# EAGLE design combined_controller (EAGLE 7.0.0)
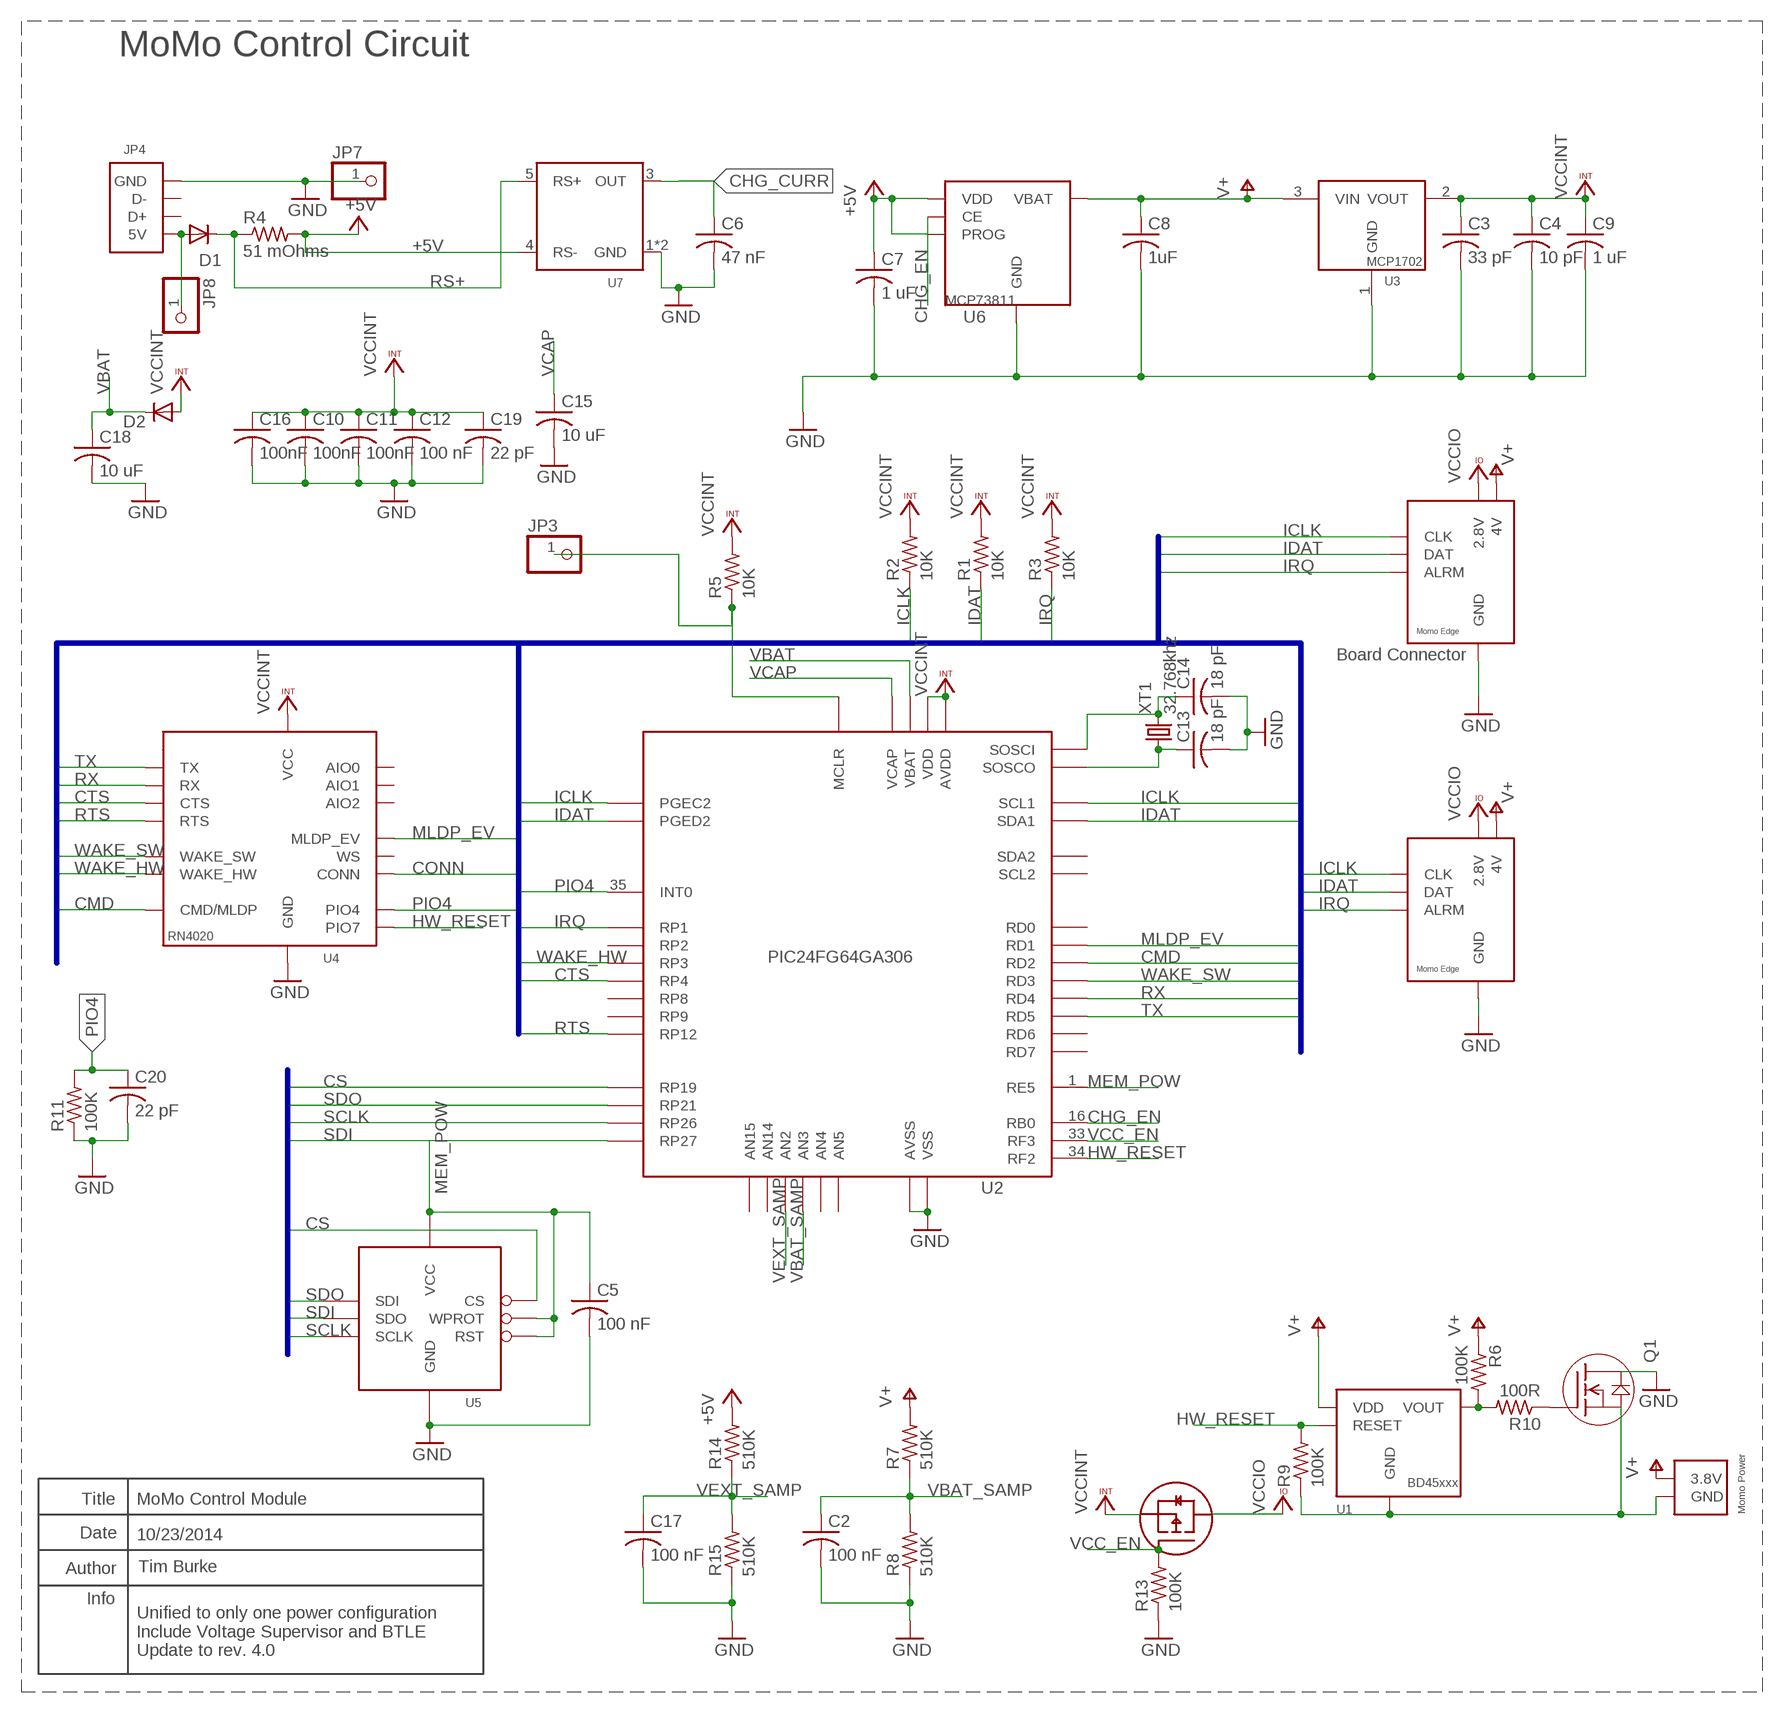
[diagram p0: schematic, sheet 1]

## Parts
C2  100 nF  C-USC0402K  [C0402K]
C3  33 pF  C-USC0402K  [C0402K]
C4  10 pF  C-USC0402K  [C0402K]
C5  100 nF  C-USC0402K  [C0402K]
C6  47 nF  C-USC0402K  [C0402K]
C7  1 uF  C-USC0402K  [C0402K]
C8  1uF  C-USC0402K  [C0402K]
C9  1 uF  C-USC0402K  [C0402K]
C10  100nF  C-USC0402K  [C0402K]
C11  100nF  C-USC0402K  [C0402K]
C12  100 nF  C-USC0402K  [C0402K]
C13  18 pF  C-USC0402K  [C0402K]
C14  18 pF  C-USC0402K  [C0402K]
C15  10 uF  C-USC0805K  [C0805K]
C16  100nF  C-USC0402K  [C0402K]
C17  100 nF  C-USC0402K  [C0402K]
C18  10 uF  C-USC0805K  [C0805K]
C19  22 pF  C-USC0402K  [C0402K]
C20  22 pF  C-USC0402K  [C0402K]
D1  DIODE-SC79_INFINEON  [SC79_INFINEON]
D2  DIODE-SC79_INFINEON  [SC79_INFINEON]
JP1  MOMO-VERT-6M  [1X06]
JP2  MOMO-EDGE-6F  [MOMO-EDGE-8F]
JP3  PINHD-1X1  [1X01]
JP4  CONN-MICROUSB-B-RCPT  [MICROUSB-B-FCI]
JP5  MOMO-PWR-HOUSED  [MOMO-PWR-HOUSED]
JP7  PINHD-1X1  [1X01]
JP8  PINHD-1X1  [1X01]
Q1  MOSFET-N  [SOT-23]
Q2  P-MOSFET  [SOT23]
R1  10K  R-US_R0603  [R0603]
R2  10K  R-US_R0603  [R0603]
R3  10K  R-US_R0603  [R0603]
R4  51 mOhms  R-US_R0805  [R0805]
R5  10K  R-US_R0603  [R0603]
R6  100K  R-US_R0603  [R0603]
R7  510K  R-US_R0603  [R0603]
R8  510K  R-US_R0603  [R0603]
R9  100K  R-US_R0603  [R0603]
R10  100R  R-US_R0603  [R0603]
R11  100K  R-US_R0603  [R0603]
R13  100K  R-US_R0603  [R0603]
R14  510K  R-US_R0603  [R0603]
R15  510K  R-US_R0603  [R0603]
U1  VOLTAGE-SUPERVISOR-BD45312  [SSOP-5]
U2  PIC24FJ64GA306  [TQFP64-10X10]
U3  MCP1702  [SOT23]
U4  RN4020_BT_4.0_MODULE  [RN20-BTLE-MODULE]
U5  FLASH8MSOP8  [SOP08]
U6  MCP73811  [SOT23-5L]
U7  TS1102-CURRENT-SENSE  [SOT23-5L]
XT1  32.768khz  XTAL-W-CAN-PAD  [TC26H]

## Nets
+5V: C7.1 R4.2 R14.2 U6.4(VDD) U6.5(PROG) U7.4(RS-)
CHG_CURR: C6.1 U7.3(OUT)
CHG_EN: U2.16(RB0) U6.1(CE)
CMD: U2.50(RD2) U4.CMD/MLDP
CONN: U4.PIO1(CONN)
CS: U2.6(RP19) U5.1(CS)
CTS: U2.43(RP4) U4.PIO5(CTS)
GND: C2.2 C3.2 C4.2 C5.2 C6.2 C7.2 C8.2 C9.2 C10.2 C11.2 C12.2 C13.2 C14.2 C15.2 C16.2 C17.2 C18.2 C19.2 C20.2 JP1.7(GND) JP2.GND JP4.5(GND) JP4.GND1(GND) JP4.GND2(GND) JP4.GND3(GND) JP4.GND4(GND) JP4.GND5(GND) JP4.GND6(GND) JP7.1 Q1.3(D) R8.1 R11.1 R13.1 R15.1 U2.9(VSS) U2.20(AVSS) U2.25(VSS) U2.41(VSS) U3.1(GND) U4.GND U4.GND1(GND) U4.SHIELD1(GND) U4.SHIELD2(GND) U4.SHIELD3(GND) U4.SHIELD4(GND) U5.4(GND) U6.2(GND) U7.1(GND) U7.2(GND)
HW_RESET: R9.2 U1.1(RESET) U2.34(RF2) U4.PIO7
ICLK: JP1.3(CLK) JP2.CLK R2.1 U2.17(PGEC2) U2.37(SCL1)
IDAT: JP1.4(DAT) JP2.DAT R1.1 U2.18(PGED2) U2.36(SDA1)
IRQ: JP1.5(ALRM) JP2.ARLM(ALRM) R3.1 U2.15(RP1)
MEM_POW: C5.1 U2.1(RE5) U5.3(WPROT) U5.7(RST) U5.8(VCC)
MLDP_EV: U2.49(RD1) U4.PIO2(MLDP_EV)
N$1: Q1.1(G) R10.1
N$4: JP3.1 R5.1 U2.7(MCLR)
N$5: JP5.2(GND) Q1.2(S) R9.1 U1.2(GND) U1.3(GND)
N$6: C14.1 U2.47(SOSCI) XT1.2
N$7: C13.1 U2.48(SOSCO) XT1.1
N$8: R6.2 R10.2 U1.4(VOUT)
N$9: D1.A JP4.1(5V) JP8.1
PIO4: C20.1 R11.2 U2.35(INT0) U4.PIO4
RS+: D1.C R4.1 U7.5(RS+)
RTS: U2.45(RP12) U4.RTS/PIO6(RTS)
RX: U2.52(RD4) U4.UART_RX(RX)
SCLK: U2.5(RP26) U5.6(SCLK)
SDI: U2.8(RP27) U5.2(SDO)
SDO: U2.4(RP21) U5.5(SDI)
TX: U2.53(RD5) U4.UART_TX(TX)
V+: C8.1 JP1.6(4V) JP2.V4(4V) JP5.1(3.8V) R6.1 R7.2 U1.5(VDD) U3.3(VIN) U6.3(VBAT)
VBAT: C18.1 D2.C U2.57(VBAT)
VBAT_SAMP: C2.1 R7.1 R8.2 U2.13(AN3)
VCAP: C15.1 U2.56(VCAP)
VCC_EN: Q2.1(GATE) R13.2 U2.33(RF3)
VCCINT: C3.1 C4.1 C9.1 C10.1 C11.1 C12.1 C16.1 C19.1 D2.A Q2.2(SOURCE) R1.2 R2.2 R3.2 R5.2 U2.10(VDD) U2.19(AVDD) U2.26(VDD) U2.38(VDD) U3.2(VOUT) U4.VDD(VCC)
VCCIO: JP1.1(2.8V) JP2.V28(2.8V) Q2.3(DRAIN)
VEXT_SAMP: C17.1 R14.1 R15.2 U2.14(AN2)
WAKE_HW: U2.44(RP3) U4.WAKE_HW
WAKE_SW: U2.51(RD3) U4.WAKE_SW
Unconnected: JP4.2(D-) JP4.3(D+) U2.11(AN5) U2.12(AN4) U2.21(RP8) U2.22(RP9) U2.29(AN14) U2.30(AN15) U2.31(SDA2) U2.32(SCL2) U2.42(RP2) U2.46(RD0) U2.54(RD6) U2.55(RD7) U4.AIO0 U4.AIO1 U4.AIO2 U4.PIO3(WS)

## Buses
SPI:CS,SDI,SDO,SCLK
SENSOR:ICLK,IDAT,IRQ,RTS,CTS,RX,TX,WAKE_SW,WAKE_HW,CMD,MLDP_EV,CONN,PIO4,PIO7

## Notes on the sheet
- MoMo Control Circuit
- Board Connector
- Title | MoMo Control Module
- Date | 10/23/2014
- Author | Tim Burke
- Info
- Unified to only one power configuration
  Include Voltage Supervisor and BTLE
  Update to rev. 4.0

## Library data of the parts
C2 C5 C10-C12 C16 C17 = rcl:C-US: CAPACITOR, American symbol; DIGIKEY-PN: 445-1265-1-ND
C3 = rcl:C-US: CAPACITOR, American symbol; DIGIKEY-PN: 1276-1272-1-ND
C4 = rcl:C-US: CAPACITOR, American symbol; DIGIKEY-PN: 1276-1139-1-ND
C6 = rcl:C-US: CAPACITOR, American symbol; DIGIKEY-PN: 1276-1573-1-ND
C7-C9 = rcl:C-US: CAPACITOR, American symbol; DIGIKEY-PN: 445-4114-1-ND
C13 C14 = rcl:C-US: CAPACITOR, American symbol; DIGIKEY-PN: 445-1238-1-ND
C15 C18 = rcl:C-US: CAPACITOR, American symbol; DIGIKEY-PN: 1276-2893-1-ND
C19 C20 = rcl:C-US: CAPACITOR, American symbol; DIGIKEY-PN: 1276-1116-1-ND
D1 D2 = diode:DIODE-: DIODE
JP1 = components:MOMO-VERT-6M; DIGIKEY-PN: S1011EC-06-ND
JP2 = components:MOMO-EDGE-6F; DESCRIPTION: 6-pin female R/A header; DIGIKEY-PN: S5442-ND; FOOTPRINT: Through Hole
JP3 = pinhead:PINHD-1X1: PIN HEADER; POPULATE: no
JP4 = custom_ics:CONN-MICROUSB-B-RCPT; DESCRIPTION: MicroUSB-B Receptacle; DIGIKEY-PN: 609-4613-1-ND; FOOTPRINT: Custom SMD
JP5 = components:MOMO-PWR-HOUSED; DESCRIPTION: R/A Shrouded 2 pin connector; DIGIKEY-PN: 455-1719-ND; FOOTPRINT: Through HOle
JP7 JP8 = pinhead:PINHD-1X1: PIN HEADER
Q1 = custom_ics:MOSFET-N; DESCRIPTION: N-Channel MOSFET IRLML2502; DIGIKEY-PN: IRLML2502PBFCT-ND; FOOTPRINT: SOT-23
Q2 = components:P-MOSFET; DESCRIPTION: P Channel MOSFET; DIGIKEY-PN: IRLML6401PBFCT-ND
R1-R3 R5 = rcl:R-US_: RESISTOR, American symbol; DIGIKEY-PN: P10.0KHCT-ND
R4 = rcl:R-US_: RESISTOR, American symbol; DIGIKEY-PN: RHM.051NCT-ND
R6 R9 R11 R13 = rcl:R-US_: RESISTOR, American symbol; DIGIKEY-PN: P100KHCT-ND
R7 R8 R14 R15 = rcl:R-US_: RESISTOR, American symbol; DIGIKEY-PN: P510KHCT-ND
R10 = rcl:R-US_: RESISTOR, American symbol; DIGIKEY-PN: RHM100CFCT-ND
U1 = custom_ics:VOLTAGE-SUPERVISOR-BD45312; DESCRIPTION: BD45312 Voltage Supervisor IC; DIGIKEY-PN: BD45312GCT-ND; FOOTPRINT: SSOP5
U2 = components:PIC24FJ64GA306; DESCRIPTION: PIC24FJ64GA306 Microcontroller; DIGIKEY-PN: PIC24FJ64GA306-I/PT-ND; FOOTPRINT: TQFN64-10mm
U3 = components:MCP1702; DESCRIPTION: MCP1702 2.8V Linear Regulator; DIGIKEY-PN: MCP1702T-2802E/CBCT-ND
U4 = custom_ics:RN4020_BT_4.0_MODULE; DESCRIPTION: RN4020 Bluetooth 4.0 Module; DIGIKEY-PN: RN4020-V/RM-ND; FOOTPRINT: Custom SMD
U5 = components:FLASH8M; DESCRIPTION: M25PX80 1MB Serial Flash; DIGIKEY-PN: M25PX80-VMN6TPCT-ND
U6 = components:MCP73811; DESCRIPTION: MCP73811 Lithium Ion Battery Charge Controller; DIGIKEY-PN: MCP73811T-420I/OTCT-ND; FOOTPRINT: SOT23-5
U7 = custom_ics:TS1102-CURRENT-SENSE; DESCRIPTION: TS1102 Current Sense Amplifier; DIGIKEY-PN: 336-3050-1-ND; FOOTPRINT: SOT23-5
XT1 = components:XTAL-W-CAN-PAD; DESCRIPTION: Quartz Crystal (Radial Can); DIGIKEY-PN: 535-9034-ND; FOOTPRINT: Through Hole

## Net classes
0 default: width 0.152 mm, drill 0.305 mm, clearance 0.152 mm

## Board
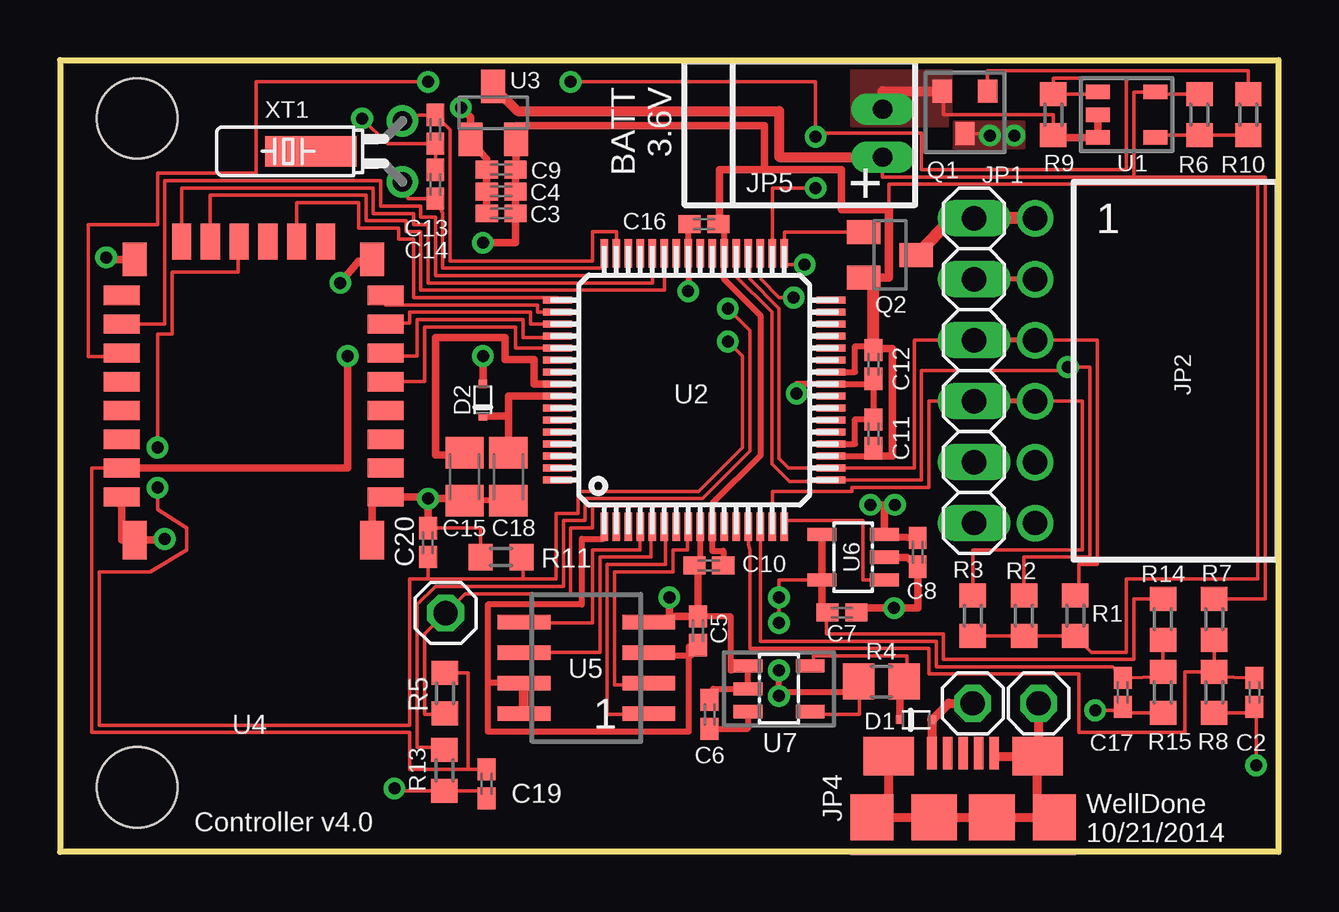
[diagram p1: board, top side]
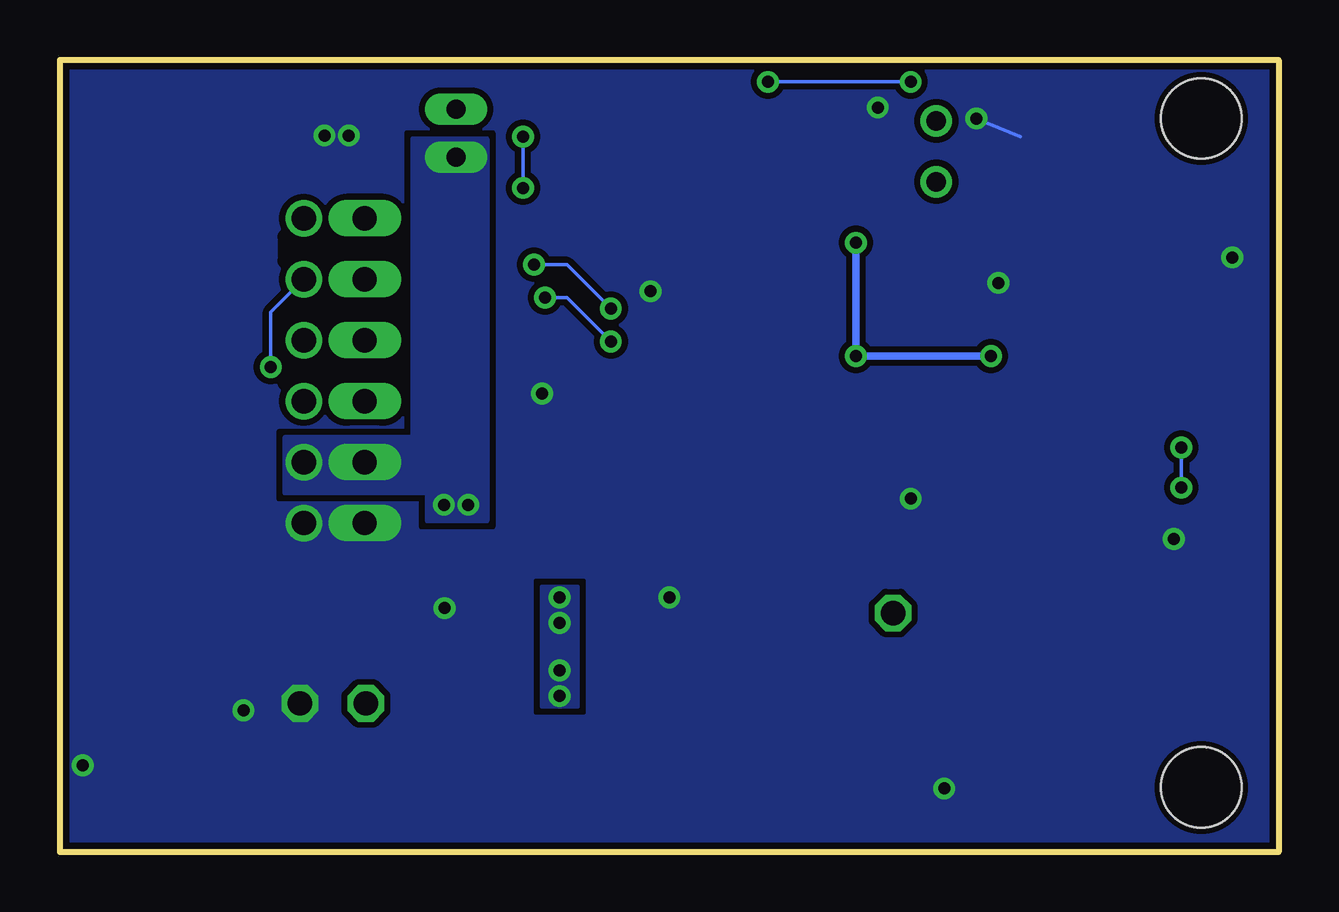
[diagram p2: board, bottom side, seen from below]

Size 50.8 x 33.02 mm. Coordinates in mm from the lower left corner, seen from the top.
Outline: 50.8,0 50.8,33.02 0,33.02 0,0 50.8,0
Copper layers (1*16): Top 0.035mm / dielectric 1.5mm / Bottom 0.035mm
Design rules "default *": minimum track width 6mil, minimum drill 19mil, track to track 6mil, track to pad 6mil, pad to pad 6mil, via to via 6mil, smd to smd 6mil, copper to edge 10mil, drill to drill 8mil, minimum pad ring 10mil, minimum via ring 8mil, stop-mask expansion 4mil, vias tented up to drill 0mil, thermal gap 10mil
Holes 3.35 mm at 3.23,2.69 3.23,30.58
bRestrict: area 41.1,19.6 to 41.4,20.6; area 41.1,24.6 to 41.4,25.7; area 41.1,22 to 41.4,22.8

### Footprints (pad centres in the part's own frame; a part is rotated, then mirrored left to right if it is on the bottom)
C0402K = smd 0.925 x 0.74: 1 -0.6,0; 2 0.6,0
C0805K = smd 1.3 x 1.6: 1 -1,0; 2 1,0
SC79_INFINEON = smd 0.35 x 0.35: A 0.675,0; C -0.675,0
1X06 = drill 1.016 long: 1 -8.89,0; 3 -6.35,0; 4 -3.81,0; 5 -1.27,0; 6 1.27,0; 7 3.81,0
MOMO-EDGE-8F = drill 1.016: ARLM 0,2.54; CLK 0,7.62; DAT 0,5.08; GND 0,-2.54; V4 0,0; V28 0,10.16
1X01 = drill 1.016 octagon: 1 0,0
MICROUSB-B-FCI = smd 0.4 x 1.35: 1 -1.3,2.675; 2 -0.65,2.675; 3 0,2.675; 4 0.65,2.675; 5 1.3,2.675 | smd 2.1 x 1.6: GND1 -3.1,2.55; GND2 3.1,2.55 | smd 1.8 x 1.9: GND3 -3.8,0; GND6 3.8,0 | smd 1.9 x 1.9: GND4 -1.2,0; GND5 1.2,0
MOMO-PWR-HOUSED = drill 0.8 long: 1 -1,0; 2 1,0
SOT-23 = smd 0.802 x 0.972: 1 -0.95,-0.885; 2 0.95,-0.885; 3 0,0.885
SOT23 = smd 1 x 1.4: 1 -0.95,-1.1; 2 0.95,-1.1; 3 0,1.1
R0603 = smd 1 x 1.1: 1 -0.85,0; 2 0.85,0
R0805 = smd 1.3 x 1.5: 1 -0.95,0; 2 0.95,0
SSOP-5 = smd 0.6 x 1: 1 0.95,1.2; 2 0,1.2; 3 -0.95,1.2; 4 -0.95,-1.2; 5 0.95,-1.2
TQFP64-10X10 = smd 1.2 x 0.3: 1 -5.7,3.75; 2 -5.7,3.25; 3 -5.7,2.75; 4 -5.7,2.25; 5 -5.7,1.75; 6 -5.7,1.25; 7 -5.7,0.75; 8 -5.7,0.25; 9 -5.7,-0.25; 10 -5.7,-0.75; 11 -5.7,-1.25; 12 -5.7,-1.75; 13 -5.7,-2.25; 14 -5.7,-2.75; 15 -5.7,-3.25; 16 -5.7,-3.75; 33 5.7,-3.75; 34 5.7,-3.25; 35 5.7,-2.75; 36 5.7,-2.25; 37 5.7,-1.75; 38 5.7,-1.25; 39 5.7,-0.75; 40 5.7,-0.25; 41 5.7,0.25; 42 5.7,0.75; 43 5.7,1.25; 44 5.7,1.75; 45 5.7,2.25; 46 5.7,2.75; 47 5.7,3.25; 48 5.7,3.75 | smd 0.3 x 1.2: 17 -3.75,-5.7; 18 -3.25,-5.7; 19 -2.75,-5.7; 20 -2.25,-5.7; 21 -1.75,-5.7; 22 -1.25,-5.7; 23 -0.75,-5.7; 24 -0.25,-5.7; 25 0.25,-5.7; 26 0.75,-5.7; 27 1.25,-5.7; 28 1.75,-5.7; 29 2.25,-5.7; 30 2.75,-5.7; 31 3.25,-5.7; 32 3.75,-5.7; 49 3.75,5.7; 50 3.25,5.7; 51 2.75,5.7; 52 2.25,5.7; 53 1.75,5.7; 54 1.25,5.7; 55 0.75,5.7; 56 0.25,5.7; 57 -0.25,5.7; 58 -0.75,5.7; 59 -1.25,5.7; 60 -1.75,5.7; 61 -2.25,5.7; 62 -2.75,5.7; 63 -3.25,5.7; 64 -3.75,5.7
RN20-BTLE-MODULE = smd 1.5 x 0.8: AIO0 0.25,7.3; AIO1 0.25,8.5; AIO2 0.25,9.7; CMD/MLDP 0.25,2.5; GND 11.25,10.9; GND1 0.25,10.9; PIO7 11.25,4.9; RSVD1 11.25,6.1; RSVD2 11.25,7.3; RSVD3 11.25,8.5; RTS/PIO6 11.25,3.7; SPI/PIO 11.25,2.5; UART_RX 0.25,4.9; UART_TX 0.25,6.1; VDD 11.25,9.7; WAKE_SW 0.25,3.7 | smd 0.8 x 1.5: PIO1 2.75,0.25; PIO2 3.95,0.25; PIO3 5.15,0.25; PIO4 6.35,0.25; PIO5 7.55,0.25; WAKE_HW 8.75,0.25 | smd 1 x 1.4: SHIELD1 0.8,1; SHIELD2 10.7,1 | smd 1 x 1.6: SHIELD3 0.8,12.7; SHIELD4 10.7,12.7
SOP08 = smd 0.6 x 2.2: 1 -1.905,-2.6; 2 -0.635,-2.6; 3 0.635,-2.6; 4 1.905,-2.6; 5 1.905,2.6; 6 0.635,2.6; 7 -0.635,2.6; 8 -1.905,2.6
SOT23-5L = smd 0.55 x 1.2: 1 -0.95,-1.3; 2 0,-1.3; 3 0.95,-1.3; 4 0.95,1.3; 5 -0.95,1.3
TC26H = drill 0.813: 1 -1.27,0; 2 1.27,0 | smd 1.27 x 3.81: NC-CAN 0,3.81

### Placement (x,y rotation side)
C2  49.78,6.65 270 top
C3  18.39,26.62 180 top
C4  18.39,27.53 180 top
C5  26.59,9.22 90 top
C6  27.08,5.74 90 top
C7  32.59,9.99 0 top
C8  35.75,12.5 270 top
C9  18.39,28.45 180 top
C10  27.05,11.95 180 top
C11  33.91,17.43 90 top
C12  33.91,20.33 270 top
C13  15.65,27.84 90 top
C14  15.65,30.12 270 top
C15  16.87,15.65 270 top
C16  26.84,26.18 180 top
C17  44.3,6.65 270 top
C18  18.69,15.65 270 top
C19  17.78,2.84 270 top
C20  15.34,12.9 90 top
D1  35.69,5.51 0 top
D2  17.63,18.85 90 top
JP1  38.1,17.53 270 top
JP2  40.64,16.26 0 top
JP3  16.07,9.96 0 top
JP4  37.64,1.45 0 top
JP5  34.29,29.97 90 top
JP7  40.79,6.2 0 top
JP8  38.05,6.2 0 top
Q1  37.72,30.84 180 top
Q2  34.59,24.89 270 top
R1  42.32,9.86 270 top
R2  40.18,9.86 270 top
R3  38.05,9.86 270 top
R4  34.24,7.11 180 top
R5  16.04,6.63 90 top
R6  47.5,30.73 270 top
R7  48.11,9.7 90 top
R8  48.11,6.65 90 top
R9  41.4,30.73 90 top
R10  49.53,30.73 270 top
R11  18.39,12.29 0 top
R13  16.03,3.4 90 top
R14  45.97,9.7 90 top
R15  45.97,6.65 90 top
U1  44.45,30.73 90 top
U2  26.44,19.26 90 top
U3  18.06,30.81 0 top
U4  13.82,25.7 180 top
U5  21.95,7.67 90 top
U6  33.06,12.29 90 top
U7  29.97,6.81 270 top
XT1  14.27,29.21 90 top

### Tracks (layer width: path | path; a pad name or v marks a point on that pad's centre or on a via)
+5V  (via drill 0.5)
  Top 0.152: R14.2 44.75,10.55 44.75,8.03 36.83,8.03 36.83,9.09 31.94,9.09 31.94,9.94 C7.1 | R4.2 33.33,7.11 33.33,5.74 31.27,5.74 U7.4 | v29.97,9.55 v29.97,10.62 29.97,11.34 U6.5
  Top 0.254: R4.2 32.83,6.65 29.97,6.65 | 29.97,6.65 v29.97,6.5 | 29.97,6.65 v29.97,7.57
  Top 0.305: C7.1 arc-90 31.76,10.22 U6.5 U6.4
  pour Bottom: 29.21,6.05 30.73,6.05 30.73,11.07 29.21,11.07
CHG_CURR
  Top 0.254: C6.1 28.67,5.14 U7.3
CHG_EN
  Top 0.152: U2.16 30.19,13.82 33.48,13.82 33.48,11.34 U6.1
CMD
  Top 0.152: U2.50 19.91,22.51 19.91,22.81 13.57,22.81 U4.CMD/MLDP
CS
  Top 0.152: U5.1 24.55,5.74 22.81,5.74 22.81,11.99 25.25,11.99 25.25,13.56 U2.6 25.22,13.53
CTS
  Top 0.152: U4.PIO5 6.27,27.38 12.75,27.38 12.75,26.31 14.43,26.31 14.43,25.86 15.04,25.86 15.04,23.42 25.19,23.42 U2.43
GND  (via drill 0.5)
  Top 0.152: R15.1 44.3,5.8 C17.2 arc-90 44.19,5.9 v43.15,5.9 | v49.86,3.62 49.86,5.73 arc90 49.78,5.8 C2.2 arc-90 49.58,5.8 R8.1 | Q1.3 38.68,29.95 v38.76,29.87 | C13.2 C14.2 13.66,29.52 v12.6,30.58 | v13.94,2.65 13.94,2.55 R13.1 17.47,2.55 C19.2 | R11.1 17.54,13.51 16.56,13.51 16.56,13.5 C20.2 | 24.79,9.58 25.4,9.58 25.4,9.82
  Top 0.254: C12.2 33.91,19.51 U2.25 30.7,19.51 v30.7,19.11 | C12.2 C11.2 33.14,18.04 33.14,17.01 U2.20 | 33.91,19.82 C12.2 | v26.18,23.38 v26.19,23.38 U2.41 26.19,26.17 C16.2 | C10.2 26.69,11.95 U2.9 | 27.23,6.65 C6.2 27.08,6.65 27.23,6.65 | 27.96,7.6 27.96,9.82 C5.2 | C18.2 C15.2 | 27.96,7.6 28.67,7.6 U7.1 U7.2 27.23,6.81 27.23,6.65 | 27.96,7.6 27.96,7.57 27.99,7.57
  Top 0.305: U6.2 35.31,12.29 C8.2 35.75,10.17 v34.77,10.17 33.25,10.17 C7.2 | C3.2 C4.2 C9.2 17.79,28.88 U3.1 17.11,30.64 v16.71,31.04 | 3.12,12.73 U4.SHIELD4 | C10.2 26.59,11.95 C5.2 25.4,9.82 v25.4,10.62 | U5.4 24.79,9.58 24.79,9.55 24.64,9.55 | C15.2 16.87,14.73 v15.34,14.73 | C20.2 v15.34,14.73 | v15.34,14.73 15.27,14.8 U4.GND1 13.02,14.8 U4.SHIELD3 | U4.SHIELD4 2.57,13.01 U4.GND | U4.SHIELD4 4.37,13.01 v4.37,13.06 | U4.SHIELD2 1.93,24.7 v1.93,24.79 | U4.SHIELD1 12.9,24.7 12.9,24.64 12.45,24.64 v11.68,23.72
  Top 0.381: JP4.5 39.07,4 JP4.GND2 | JP4.GND2 40.79,4.05 JP7.1 | JP4.GND2 40.74,2.15 JP4.GND6 JP4.GND5 JP4.GND4 JP4.GND3 33.78,1.51 33.78,1.63 34.54,2.39 JP4.GND1
  Bottom 0.152: v12.6,30.58 10.77,29.82
  other vias: 39.78,29.87
  pour Bottom (isolate 0.254, rank 2, no thermals): 0.41,0.25 51,-0.41 50.7,32.87 0.41,32.87
  pour Top (no thermals): 37.29,30.43 40.18,30.43 40.18,29.36 37.29,29.36
HW_RESET  (via drill 0.5)
  Top 0.152: U1.1 43.25,31.58 R9.2 41.4,32.26 44.45,32.26 44.45,28.45 35.92,28.45 35.92,29.97 31.5,29.97 v31.5,29.82 31.5,32.11 v21.28,32.11 | v15.34,32.11 8.18,32.11 8.18,28.3 4.06,28.3 4.06,26.16 1.17,26.16 1.17,20.65 2.57,20.65 U4.PIO7 | U2.34 29.69,27.69 v31.5,27.69
  Bottom 0.152: v31.5,27.69 v31.5,29.82 | v15.34,32.11 v21.28,32.11
ICLK  (via drill 0.5)
  Top 0.152: U2.37 28.14,24.92 28.14,24.03 29.67,22.5 29.67,16.18 30.4,15.45 32.08,15.45 U2.17 35.92,15.51 35.92,20.07 41.86,20.07 v42.01,20.22 42.93,20.22 42.93,12.29 40.18,12.29 R2.1
  Top 0.203: JP2.CLK JP1.3
  Bottom 0.152: v42.01,20.22 42.01,22.5 JP2.CLK
IDAT
  Top 0.152: 28.72,24.96 U2.36 28.75,24.9 28.75,23.88 29.97,22.66 29.97,16.41 30.37,16.01 U2.18 35.61,16.01 35.61,21.34 JP1.4 | JP2.DAT 43.23,21.34 43.23,11.99 42.47,11.99 42.47,10.71 R1.1
  Top 0.203: JP2.DAT JP1.4
IRQ
  Top 0.152: U2.15 29.69,15.04 33.02,15.04 33.02,15.19 36.22,15.19 36.22,18.8 JP1.5 | JP2.ARLM 42.62,18.8 42.62,12.6 38.05,12.6 R3.1
  Top 0.203: JP2.ARLM JP1.5
MEM_POW
  Top 0.203: U5.7 19.35,7.06 | 17.83,7.06 17.83,6.96 | 26.21,8.57 C5.1
  Top 0.254: 19.35,7.06 17.83,7.06 | U5.3 24.55,8.18 26.31,8.18 26.31,8.57 26.21,8.57 26.21,5.03 17.83,5.03 17.83,6.96 17.83,10.31 21.74,10.31 21.74,13.06 22.66,13.06 22.66,13.56 U2.1
  Top 0.406: U5.8 U5.7
MLDP_EV
  Top 0.152: U4.PIO2 9.87,27.08 12.45,27.08 12.45,26.01 14.12,26.01 14.12,25.55 14.73,25.55 14.73,23.11 20.74,23.11 U2.49
N$1
  Top 0.152: R10.1 49.53,32.56 38.66,32.56 Q1.1
N$4
  Top 0.152: U2.7 25.69,14.43 22.2,14.43 22.2,13.51 21.28,13.51 21.28,10.77 16.88,10.77 JP3.1 | JP3.1 15.95,9.96 | JP3.1 16.06,9.96 15.19,9.09 15.19,5.74 16.01,5.74 R5.1
N$5
  Top 0.152: R9.1 41.4,30.73 36.83,30.73 36.83,31.72 Q1.2
  Top 0.305: R9.1 41.4,29.78 U1.3 U1.2
  Top 0.406: JP5.2 34.29,31.72 Q1.2
  pour Top (no thermals): 33.02,30.28 36.98,30.28 36.98,30.73 37.13,30.73 37.13,32.56 33.02,32.56
N$6
  Top 0.152: U2.47 23.19,25.86 22.2,25.86 22.2,24.64 16.26,24.64 16.26,30.11 C14.1 14.98,30.72 XT1.2
N$7
  Top 0.152: U2.48 22.69,24.33 15.95,24.33 15.95,26.63 C13.1 14.52,27.24 XT1.1
N$8
  Top 0.152: U1.4 45.65,29.88 R6.2 R10.2
N$9
  Top 0.381: JP4.1 36.34,5.51 D1.A 37.05,6.2 JP8.1
PIO4  (via drill 0.5)
  Top 0.152: U4.PIO4 7.42,25.45 7.42,24.18 4.67,24.18 4.67,21.59 4.06,21.59 v4.06,16.87 | v4.06,15.19 4.06,14.28 5.28,13.51 5.28,12.6 3.76,11.68 1.63,11.68 1.63,5.28 14.58,5.28 14.58,11.38 15.34,11.38 | 15.34,11.38 19.3,11.38 | 19.3,11.38 20.68,11.38 20.68,14.12 21.59,14.12 21.59,15.04 26.62,15.04 28.45,16.87 28.45,20.68 v27.84,21.28 | v30.58,23.11 29.97,23.11 29.21,23.88 29.21,24.94 U2.35 | C20.1 15.34,11.38 | R11.2 19.3,12.23 19.3,11.38
  Bottom 0.152: v4.06,16.87 v4.06,15.19 | v27.84,21.28 29.67,23.11 v30.58,23.11
RS+
  Top 0.152: R4.1 35.31,7.11 35.31,8.18 31.41,8.18 31.41,7.76 U7.5
  Top 0.305: D1.C 35.01,6.94 arc-90 R4.1
RTS
  Top 0.152: U2.45 24.19,24.03 15.65,24.03 15.65,26.47 15.04,26.47 15.04,26.92 13.36,26.92 13.36,27.99 4.37,27.99 4.37,22 U4.RTS/PIO6
RX
  Top 0.152: U2.52 20.74,21.44 19.3,21.44 19.3,22.2 14.88,22.2 14.88,20.68 13.57,20.68 U4.UART_RX
SCLK
  Top 0.152: U5.6 19.35,8.33 22.5,8.33 22.5,12.29 24.64,12.29 24.64,13.56 U2.5
SDI
  Top 0.152: U5.2 24.55,6.96 23.11,6.96 23.11,11.68 25.55,11.68 25.55,12.6 26.16,12.6 26.16,13.56 U2.8
SDO
  Top 0.152: 24.15,13.56 U2.4 24.18,12.6 22.2,12.6 22.2,9.55 19.35,9.55 U5.5
TX
  Top 0.152: U2.53 19,21.01 19,21.89 15.19,21.89 15.19,19.61 U4.UART_TX
V+  (via drill 0.5)
  Top 0.152: R6.1 45.65,31.58 U1.5 44.75,31.68 44.75,28.14 | JP5.1 34.29,28.14 44.75,28.14 | R7.2 50.24,10.55 50.24,28.14 44.75,28.14
  Top 0.305: 34.36,14.48 U6.3 34.36,13.15 C8.1 | 34.36,14.48 v33.78,14.48 | v34.8,14.48 34.36,14.48
  Top 0.406: U3.3 19.08,30.89 29.97,30.89 29.97,28.97 JP5.1
  pour Bottom (no thermals): 33.02,29.72 33.02,14.99 41.4,14.99 41.4,17.27 36.07,17.27 36.07,29.72
  pour Bottom: 33.02,15.04 33.02,13.82 35.46,13.82 35.46,15.04
VBAT
  Top 0.305: C18.1 18.69,18.17 | 18.69,18.17 D2.C | U2.57 18.69,19.01 18.69,18.17
VBAT_SAMP
  Top 0.152: R8.2 48.11,7.3 C2.1 | R8.2 46.89,7.51 46.89,4.98 42.47,4.98 42.47,7.42 36.22,7.42 36.22,8.48 28.75,8.48 28.75,12.6 28.69,12.82 U2.13 | R7.1 R8.2
VCAP
  Top 0.305: U2.56 19.76,19.51 19.76,20.52 18.54,20.52 18.54,21.44 15.65,21.44 15.65,16.56 16.78,16.56 C15.1
VCC_EN  (via drill 0.5)
  Top 0.152: 33.63,25.84 Q2.1 30.19,25.84 U2.33 30.19,24.49 v31.04,24.49 | v27.84,22.66 28.75,21.74 28.75,16.71 26.77,14.73 21.89,14.73 21.89,13.82 20.98,13.82 20.98,11.07 15.65,11.07 14.88,10.31 14.88,4.37 16.03,4.37 R13.2
  Bottom 0.152: v27.84,22.66 29.67,24.49 v31.04,24.49
VCCINT  (via drill 0.5)
  Top 0.152: R3.2 R2.2 R1.2 42.99,8.33 44.45,8.33 44.45,11.38 49.94,11.38 49.94,27.84 34.54,27.84 34.54,26.77 | R5.2 17.02,7.48 17.02,3.45 | U4.VDD 1.32,16.01 1.32,4.98 14.58,4.98 14.58,3.45 17.02,3.45 | C19.1 17.02,3.44 17.02,3.45
  Top 0.254: U2.26 33.14,20.01 33.14,21.09 33.91,21.09 C12.1 | 33.91,16.66 C11.1 | 27.2,13.56 U2.10 27.19,12.56 27.65,12.56 C10.1 | U2.19 34.39,16.51 | C16.1 27.69,25.98 U2.38 27.69,23.88 29.21,22.35 29.21,16.56 27.2,14.55 27.2,13.57
  Top 0.305: 27.2,13.57 U2.10 | C11.1 arc-90 33.79,16.51 34.39,16.51 34.7,16.51 34.7,20.98 33.91,20.98 C12.1 | C3.1 C4.1 C9.1 19.01,28.14 U3.2 19.01,30.28 29.36,30.28 29.36,28.45 | v11.99,20.68 11.99,16.01 U4.VDD | v17.63,25.4 18.99,25.4 C3.1 | C3.1 19,27.08 | v17.63,20.68 D2.A | 34.54,26.77 32.56,26.77 32.56,28.45 29.36,28.45 | C16.1 27.49,26.23 27.49,28.45 29.36,28.45
  Top 0.356: 34.54,26.77 34.54,23.94 Q2.2
  Top 0.508: 33.91,21.09 33.91,23.94 Q2.2
  Bottom 0.305: v17.63,25.4 v17.63,20.68 v11.99,20.68
VCCIO
  Top 0.508: JP2.V28 JP1.1 37.22,26.42 Q2.3
VEXT_SAMP
  Top 0.152: R14.1 R15.2 45.97,7.3 C17.1 43.88,7.72 36.53,7.72 36.53,8.79 29.19,8.79 U2.14
WAKE_HW
  Top 0.152: U4.WAKE_HW 5.07,27.69 13.06,27.69 13.06,26.62 14.73,26.62 14.73,26.16 15.34,26.16 15.34,23.72 24.69,23.72 U2.44
WAKE_SW
  Top 0.152: U2.51 19.61,22.01 19.61,22.5 14.58,22.5 14.58,22.05 13.57,22.05 U4.WAKE_SW

### Text on the board
tPlace: BATT / 3.6V | + | Controller v4.0 | WellDone / 10/21/2014
Reference: + | -